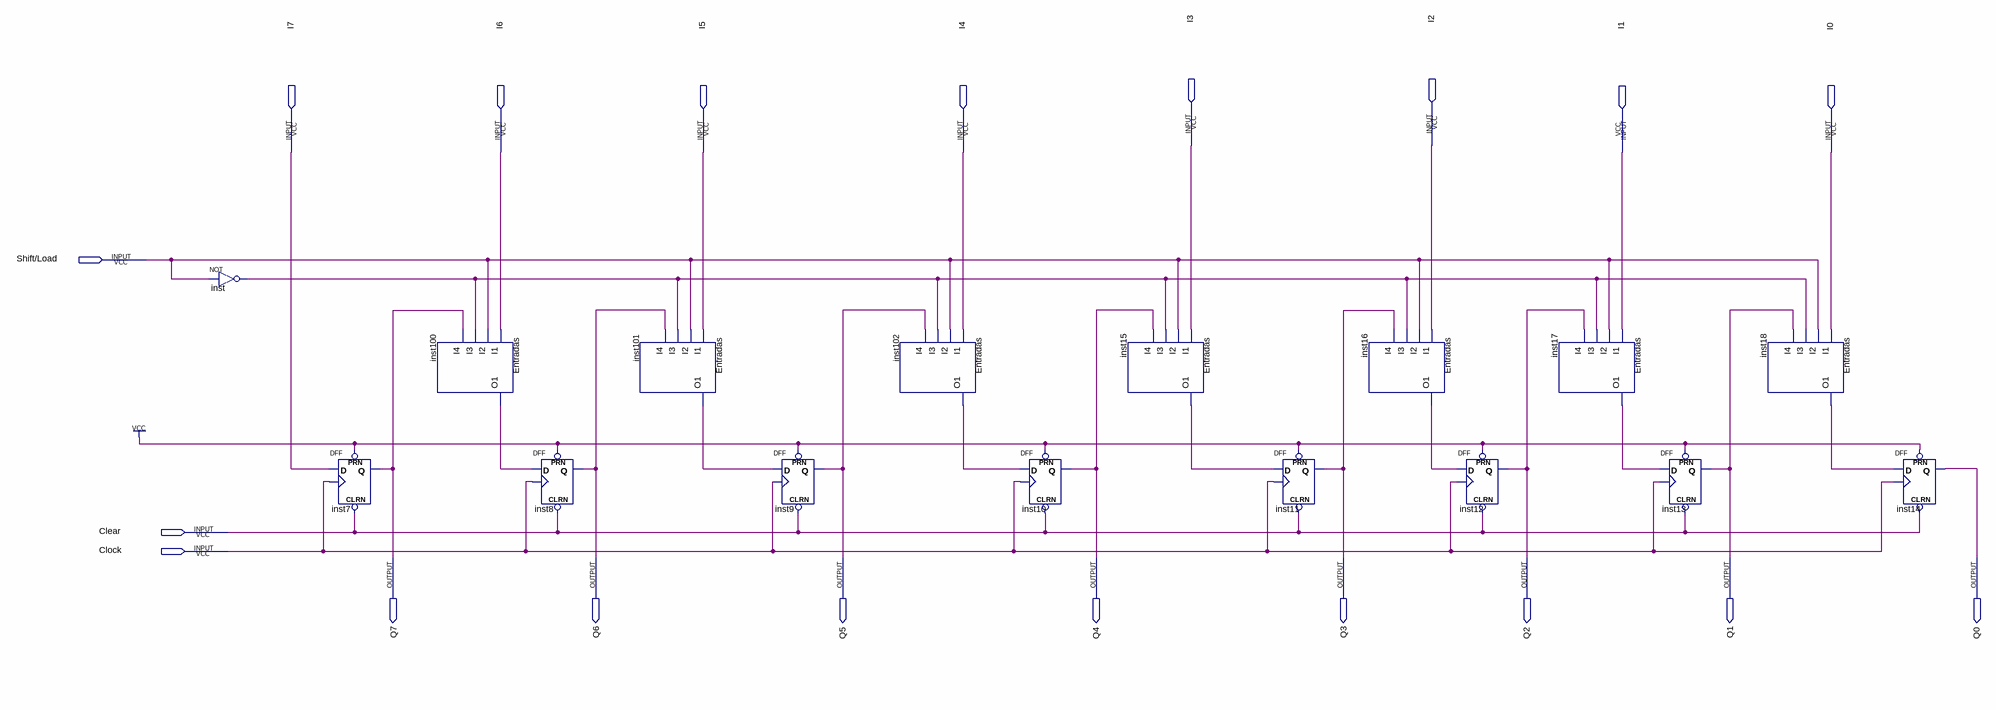
[diagram p0: schematic sheet]
// Quartus schematic RegistradorPISO.bdf as structural Verilog: 16 symbols, 19 pins
module RegistradorPISO (
  input  I3,
  input  I2,
  input  I7,
  input  I6,
  input  I5,
  input  I4,
  input  I1,
  input  I0,
  input  \Shift/Load ,
  input  Clear,
  input  Clock,
  output Q7,
  output Q6,
  output Q5,
  output Q4,
  output Q3,
  output Q2,
  output Q1,
  output Q0
);

  wire inst15_o1, inst16_o1, inst17_o1, inst18_o1, inst100_o1, inst101_o1, inst102_o1, inst_out;

  not inst (inst_out, \Shift/Load );
  DFF inst7 (.CLRN(Clear), .CLK(Clock), .D(I7), .PRN(1'b1), .Q(Q7));
  Entradas inst100 (.I1(I6), .I2(\Shift/Load ), .I3(inst_out), .I4(Q7), .O1(inst100_o1));
  DFF inst8 (.CLRN(Clear), .CLK(Clock), .D(inst100_o1), .PRN(1'b1), .Q(Q6));
  Entradas inst101 (.I1(I5), .I2(\Shift/Load ), .I3(inst_out), .I4(Q6), .O1(inst101_o1));
  DFF inst9 (.CLRN(Clear), .CLK(Clock), .D(inst101_o1), .PRN(1'b1), .Q(Q5));
  Entradas inst102 (.I1(I4), .I2(\Shift/Load ), .I3(inst_out), .I4(Q5), .O1(inst102_o1));
  DFF inst10 (.CLRN(Clear), .CLK(Clock), .D(inst102_o1), .PRN(1'b1), .Q(Q4));
  Entradas inst15 (.I1(I3), .I2(\Shift/Load ), .I3(inst_out), .I4(Q4), .O1(inst15_o1));
  DFF inst11 (.CLRN(Clear), .CLK(Clock), .D(inst15_o1), .PRN(1'b1), .Q(Q3));
  Entradas inst16 (.I1(I2), .I2(\Shift/Load ), .I3(inst_out), .I4(Q3), .O1(inst16_o1));
  DFF inst12 (.CLRN(Clear), .CLK(Clock), .D(inst16_o1), .PRN(1'b1), .Q(Q2));
  Entradas inst17 (.I1(I1), .I2(\Shift/Load ), .I3(inst_out), .I4(Q2), .O1(inst17_o1));
  DFF inst13 (.CLRN(Clear), .CLK(Clock), .D(inst17_o1), .PRN(1'b1), .Q(Q1));
  Entradas inst18 (.I1(I0), .I2(\Shift/Load ), .I3(inst_out), .I4(Q1), .O1(inst18_o1));
  DFF inst14 (.CLRN(Clear), .CLK(Clock), .D(inst18_o1), .PRN(1'b1), .Q(Q0));
endmodule
